# EAGLE design BJ_GIRA_Taster4.4 (EAGLE 5.04)
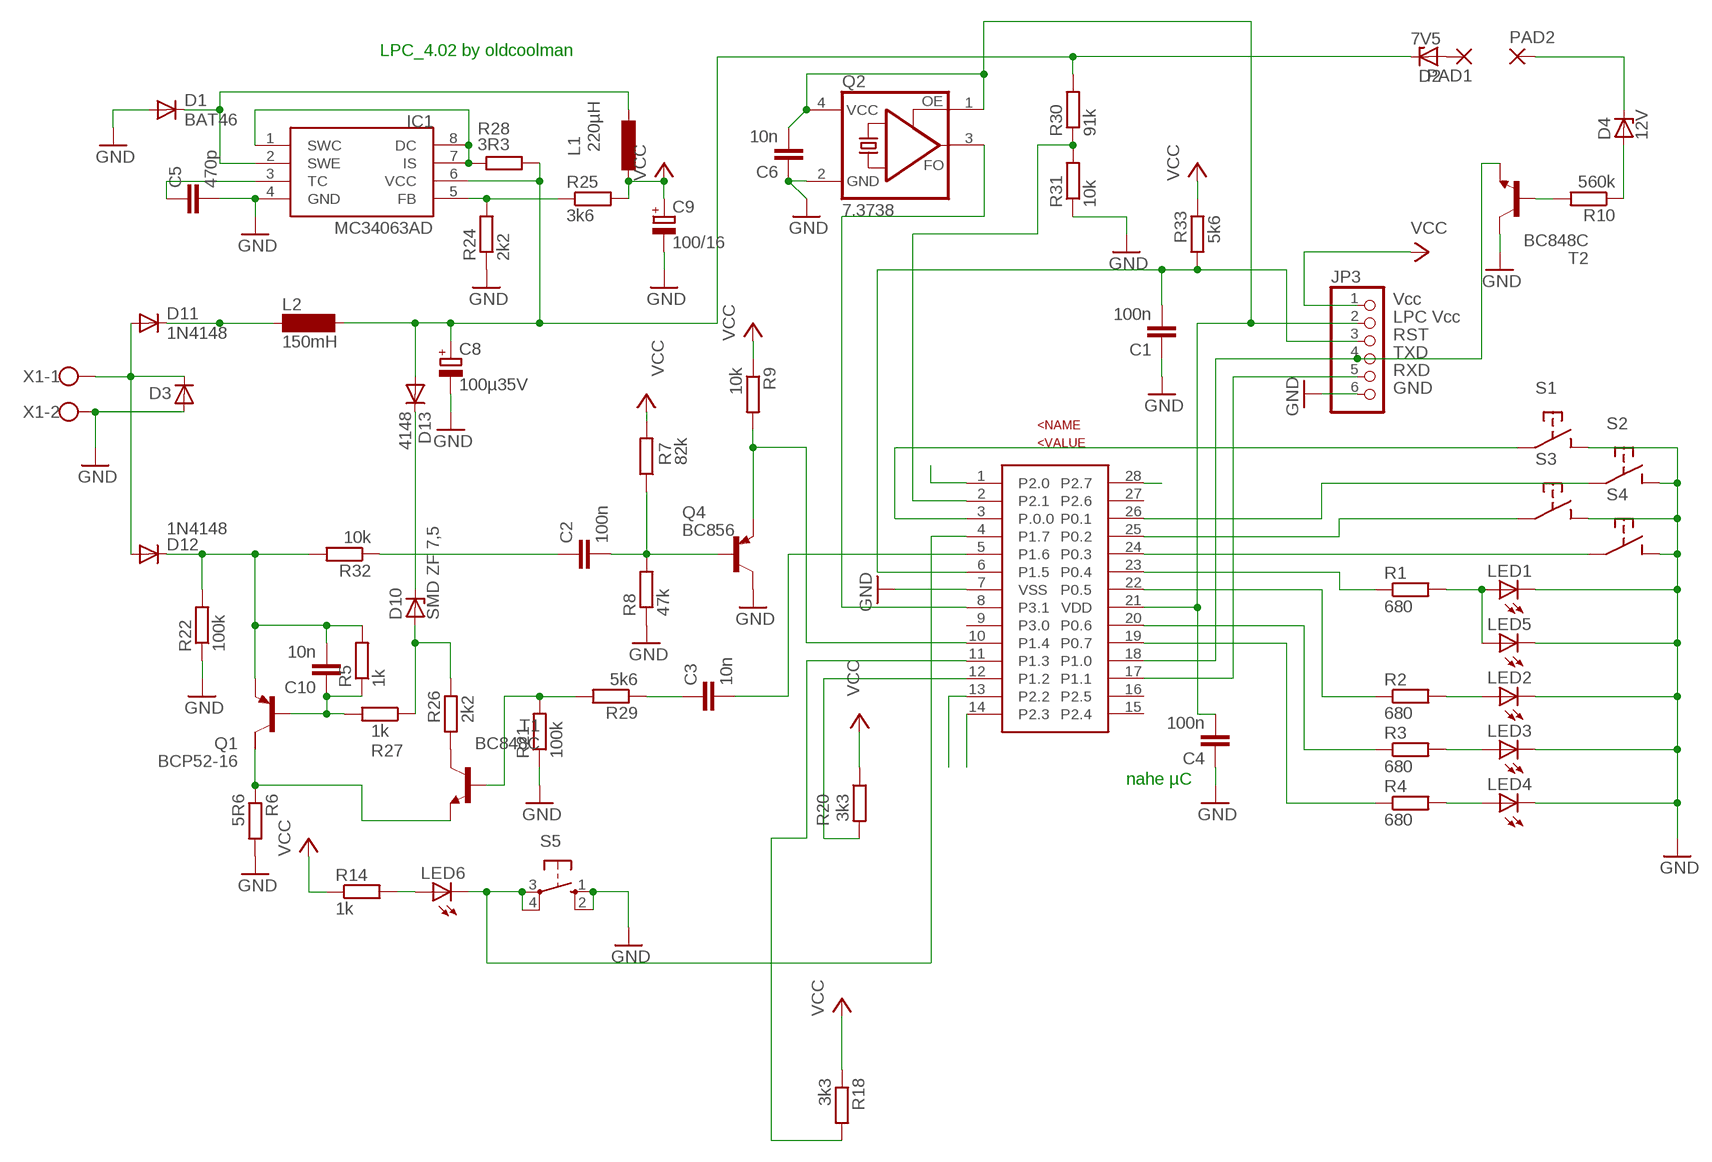
[diagram p0: schematic, sheet 1]

## Parts
C1  100n  C-EUC1206  [C1206]
C2  100n  C-EUC1206  [C1206]
C3  10n  C-EUC1206  [C1206]
C4  100n  C-EUC1206  [C1206]
C5  470p  C-EUC1206  [C1206]
C6  10n  C-EUC1206  [C1206]
C8  100µ35V  CPOL-EUE3.5-8  [E3,5-8]
C9  100/16  CPOL-EUE2.5-5  [E2,5-5]
C10  10n  C-EUC1206  [C1206]
D1  BAT46  DIODE-MINIMELF  [MINIMELF]
D2  7V5  ZPD  [MINIMELF]
D3  D-SMB  [SMB]
D4  12V  ZPD  [MINIMELF]
D10  SMD ZF 7,5  ZPD  [MINIMELF]
D11  1N4148  DIODE-MINIMELF  [MINIMELF]
D12  1N4148  DIODE-MINIMELF  [MINIMELF]
D13  4148  DIODE-MINIMELF  [MINIMELF]
IC1  MC34063AD  [SOIC8]
JP3  PINHD-1X6  [1X06]
L1  220µH  L-EU2200-11.43  [2200-11.43]
L2  150mH  BS11  [BS11]
LED1  LED3MM  [LED3MM]
LED2  LED3MM  [LED3MM]
LED3  LED3MM  [LED3MM]
LED4  LED3MM  [LED3MM]
LED5  LED3MM  [LED3MM]
LED6  LED3MM  [LED3MM]
PAD1  SMD2  [SMD1,27-2,54]
PAD2  SMD2  [SMD1,27-2,54]
Q1  BCP52-16  FZT753SMD  [SOT223]
Q2  7.3738  ASFL1  [ASF]
Q4  BC856  BC856ALT1SMD  [SOT23-BEC]
R1  680  R-EU_R1206  [R1206]
R2  680  R-EU_R1206  [R1206]
R3  680  R-EU_R1206  [R1206]
R4  680  R-EU_R1206  [R1206]
R5  1k  R-EU_R1206  [R1206]
R6  5R6  R-EU_R1206  [R1206]
R7  82k  R-EU_R1206  [R1206]
R8  47k  R-EU_M1206  [M1206]
R9  10k  R-EU_R1206  [R1206]
R10  560k  R-EU_R1206  [R1206]
R14  1k  R-EU_R1206  [R1206]
R18  3k3  R-EU_R1206  [R1206]
R20  3k3  R-EU_M1206  [M1206]
R21  100k  R-EU_R1206  [R1206]
R22  100k  R-EU_M1206  [M1206]
R24  2k2  R-EU_R1206  [R1206]
R25  3k6  R-EU_M1206  [M1206]
R26  2k2  R-EU_M1206  [M1206]
R27  1k  R-EU_R1206  [R1206]
R28  3R3  R-EU_M1206  [M1206]
R29  5k6  R-EU_R1206  [R1206]
R30  91k  R-EU_R1206  [R1206]
R31  10k  R-EU_R1206  [R1206]
R32  10k  R-EU_R1206  [R1206]
R33  5k6  R-EU_M1206  [M1206]
S1  33053305A  [3305A]
S2  33053305A  [3305A]
S3  33053305A  [3305A]
S4  33053305A  [3305A]
S5  10-XX  [B3F-10XX]
T1  BC848C  BC848  [SOT23]
T2  BC848C  BC848  [SOT23]
U$1  LPC936TSSOP28  [TSSOP28]
X1  W237-02P  [W237-132]

## Nets
DRAIN: R26.1 T1.3(C)
EIB+: D3.1(C) D11.A D12.A X1.1
EIB_AC: C10.2 D12.C Q1.3(E) R5.2 R22.2 R32.2
EIB_DC: C8.+ D2.C D13.A IC1.6(VCC) L2.2 R28.2 R30.2
EIBIN: Q4.E R9.2 U$1.10(P1.4)
GND: C1.1 C4.1 C5.2 C6.1 C8.- C9.- D1.A D3.2(A) IC1.4(GND) JP3.6 LED1.K(C) LED2.K(C) LED3.K(C) LED4.K(C) LED5.K(C) Q2.2(GND) Q4.C R6.2 R8.1 R21.1 R22.1 R24.1 R31.1 S1.P$2 S2.P$2 S3.P$2 S4.P$2 S5.1(S) S5.2(S1) T2.3(C) U$1.7(VSS) X1.2
INT0: R18.2 U$1.11(P1.3)
N$1: C10.1 Q1.1(B) R5.1 R27.2
N$2: C3.1 R29.1
N$3: D2.A PAD1.1(P)
N$4: LED2.A R2.2
N$5: LED3.A R3.2
N$6: LED4.A R4.2
N$7: R10.2 T2.1(B)
N$8: LED1.A LED5.A R1.2
N$9: LED6.A R14.2
N$10: D4.A R10.1
N$11: D4.C PAD2.1(P)
N$50: IC1.5(FB) R24.2 R25.1
N$51: D1.C IC1.2(SWE) L1.2
N$52: C5.1 IC1.3(TC)
N$53: D11.C L2.1
N$58: D10.C D13.C
N$59: Q2.3(FO) U$1.8(P3.1)
N$63: IC1.1(SWC) IC1.7(IS) IC1.8(DC) R28.1
N$75: R30.1 R31.2 U$1.2(P2.1)
N$77: C2.1 R32.1
P0.0: S1.P$1 U$1.3(P.0.0)
P0.1: S2.P$1 U$1.26(P0.1)
P0.2: S3.P$1 U$1.25(P0.2)
P0.3: S4.P$1 U$1.24(P0.3)
P0.4: R1.1 U$1.23(P0.4)
P0.6: R3.1 U$1.20(P0.6)
P0_5: R2.1 U$1.22(P0.5)
P0_7: R4.1 U$1.19(P0.7)
P2_0: U$1.1(P2.0)
P2_2: U$1.13(P2.2)
P2_3: U$1.14(P2.3)
P2_7: U$1.28(P2.7)
PROG: LED6.K(C) S5.3(P) S5.4(P1) U$1.4(P1.7)
PWM: R20.2 U$1.12(P1.2)
RECIEVE_B: C2.2 Q4.B R7.1 R8.2
RST: C1.2 JP3.3 R33.1 U$1.6(P1.5)
RXD: JP3.5 U$1.17(P1.1)
SEND_B: R21.2 R29.2 T1.1(B)
SEND_E: Q1.2(C) R6.1 T1.2(E)
SEND_REF: D10.A R26.2 R27.1
T1: C3.2 U$1.5(P1.6)
TXD: JP3.4 T2.2(E) U$1.18(P1.0)
VCC: C9.+ JP3.1 L1.1 R7.2 R9.1 R14.1 R18.1 R20.1 R25.2 R33.2
VCC_LPC: C4.2 C6.2 JP3.2 Q2.1(OE) Q2.4(VCC) U$1.21(VDD)
Unconnected: Q1.4(C/) U$1.9(P3.0) U$1.15(P2.4) U$1.16(P2.5) U$1.27(P2.6)

## Notes on the sheet
- LPC_4.02 by oldcoolman
- Vcc
- LPC Vcc
- RST
- TXD
- RXD
- GND
- nahe µC

## Library data of the parts
C1-C6 C10 = rcl:C-EU: CAPACITOR, European symbol
C8 C9 = rcl:CPOL-EU: POLARIZED CAPACITOR, European symbol
D1 D11-D13 = diode:DIODE-: DIODE
D2 D4 D10 = diode:ZPD: Z DIODE 500 mW
D3 = semicon-smd-ipc:D-: DIODE unfilled
IC1 = mc34063:MC34063
JP3 = pinhead:PINHD-1X6: PIN HEADER
L1 = rcl:L-EU: INDUCTOR, European symbol
L2 = inductor-neosid:BS: INDUCTOR nominal inductance, magnetically screened
LED1-LED6 = led:LED: LED OSRAM: - CHIPLED LG R971, LG N971, LY N971, LG Q971, LY Q971, LO R971, LY R971 LH N974, LH R974 LS Q976, LO Q976, LY Q976 LO Q996 - Hyper CHIPLED LW Q18S LB Q993, LB Q99A, LB R99A - SideLED LS A670, LO A670, LY A670, LG A670, LP A670 LB A673, LV A673, LT A673, LW A673 LH A674 LY A675 LS A676, LA A676, LO A676, LY A676, LW A676 LS A679, LY A679, LG A679 - Hyper Micro SIDELED® LS Y876, LA Y876, LO Y876, LY Y876 LT Y87S - SmartLED LW L88C, LW L88S LB L89C, LB L89S, LG L890 LS L89K, LO L89K, LY L89K LS L896, LA L896, LO L896, LY L896 - TOPLED LS T670, LO T670, LY T670, LG T670, LP T670 LSG T670, LSP T670, LSY T670, LOP T670, LYG T670 LG T671, LOG T671, LSG T671 LB T673, LV T673, LT T673, LW T673 LH T674 LS T676, LA T676, LO T676, LY T676, LB T676, LH T676, LSB T676, LW T676 LB T67C, LV T67C, LT T67C, LS T67K, LO T67K, LY T67K, LW E67C LS E67B, LA E67B, LO E67B, LY E67B, LB E67C, LV E67C, LT E67C LW T67C LS T679, LY T679, LG T679 LS T770, LO T770, LY T770, LG T770, LP T770 LB T773, LV T773, LT T773, LW T773 LH T774 LS E675, LA E675, LY E675, LS T675 LS T776, LA T776, LO T776, LY T776, LB T776 LHGB T686 LT T68C, LB T68C - Hyper Mini TOPLED® LB M676 - Mini TOPLED Santana® LG M470 LS M47K, LO M47K, LY M47K Source: http://www.osram.convergy.de - LUMILED® LXK2-PW12-R00, LXK2-PW12-S00, LXK2-PW14-U00, LXK2-PW14-V00 LXK2-PM12-R00, LXK2-PM12-S00, LXK2-PM14-U00 LXK2-PE12-Q00, LXK2-PE12-R00, LXK2-PE12-S00, LXK2-PE14-T00, LXK2-PE14-U00 LXK2-PB12-K00, LXK2-PB12-L00, LXK2-PB12-M00, LXK2-PB14-N00, LXK2-PB14-P00, LXK2-PB14-Q00 LXK2-PR12-L00, LXK2-PR12-M00, LXK2-PR14-Q00, LXK2-PR14-R00 LXK2-PD12-Q00, LXK2-PD12-R00, LXK2-PD12-S00 LXK2-PH12-R00, LXK2-PH12-S00 LXK2-PL12-P00, LXK2-PL12-Q00, LXK2-PL12-R00 Source: www.luxeon.com
PAD1 PAD2 = wirepad:SMD2: SMD PAD
Q1 = transistor-pnp:FZT753SMD: PNP Transistor
Q2 = crystal:ASF*: CRYSTAL CLOCK OSCILLATORS 5.0 Vdc or 3.3 Vdc - LOW PROFILE ULTRA MINIATURE CERAMIC SURFACE MOUNT Source: http://www.abracon.com/Oscillators/asf1-L-L1.pdf
Q4 = transistor-pnp:BC856*: PNP Transistror
R1-R10 R14 R18 R20-R22 R24-R33 = rcl:R-EU_: RESISTOR, European symbol
S1-S4 = kubi:3305: Taster 3305
S5 = switch-omron:10-XX: OMRON SWITCH
T1 T2 = transistor:BC848: NPN TRANSISTOR
U$1 = freebuslpc:LPC936: C51 Based Microcontroller LPC936 ADC and 16kbyte Flash
X1 = con-wago-508:W237-02P: WAGO SREW CLAMP

## Board
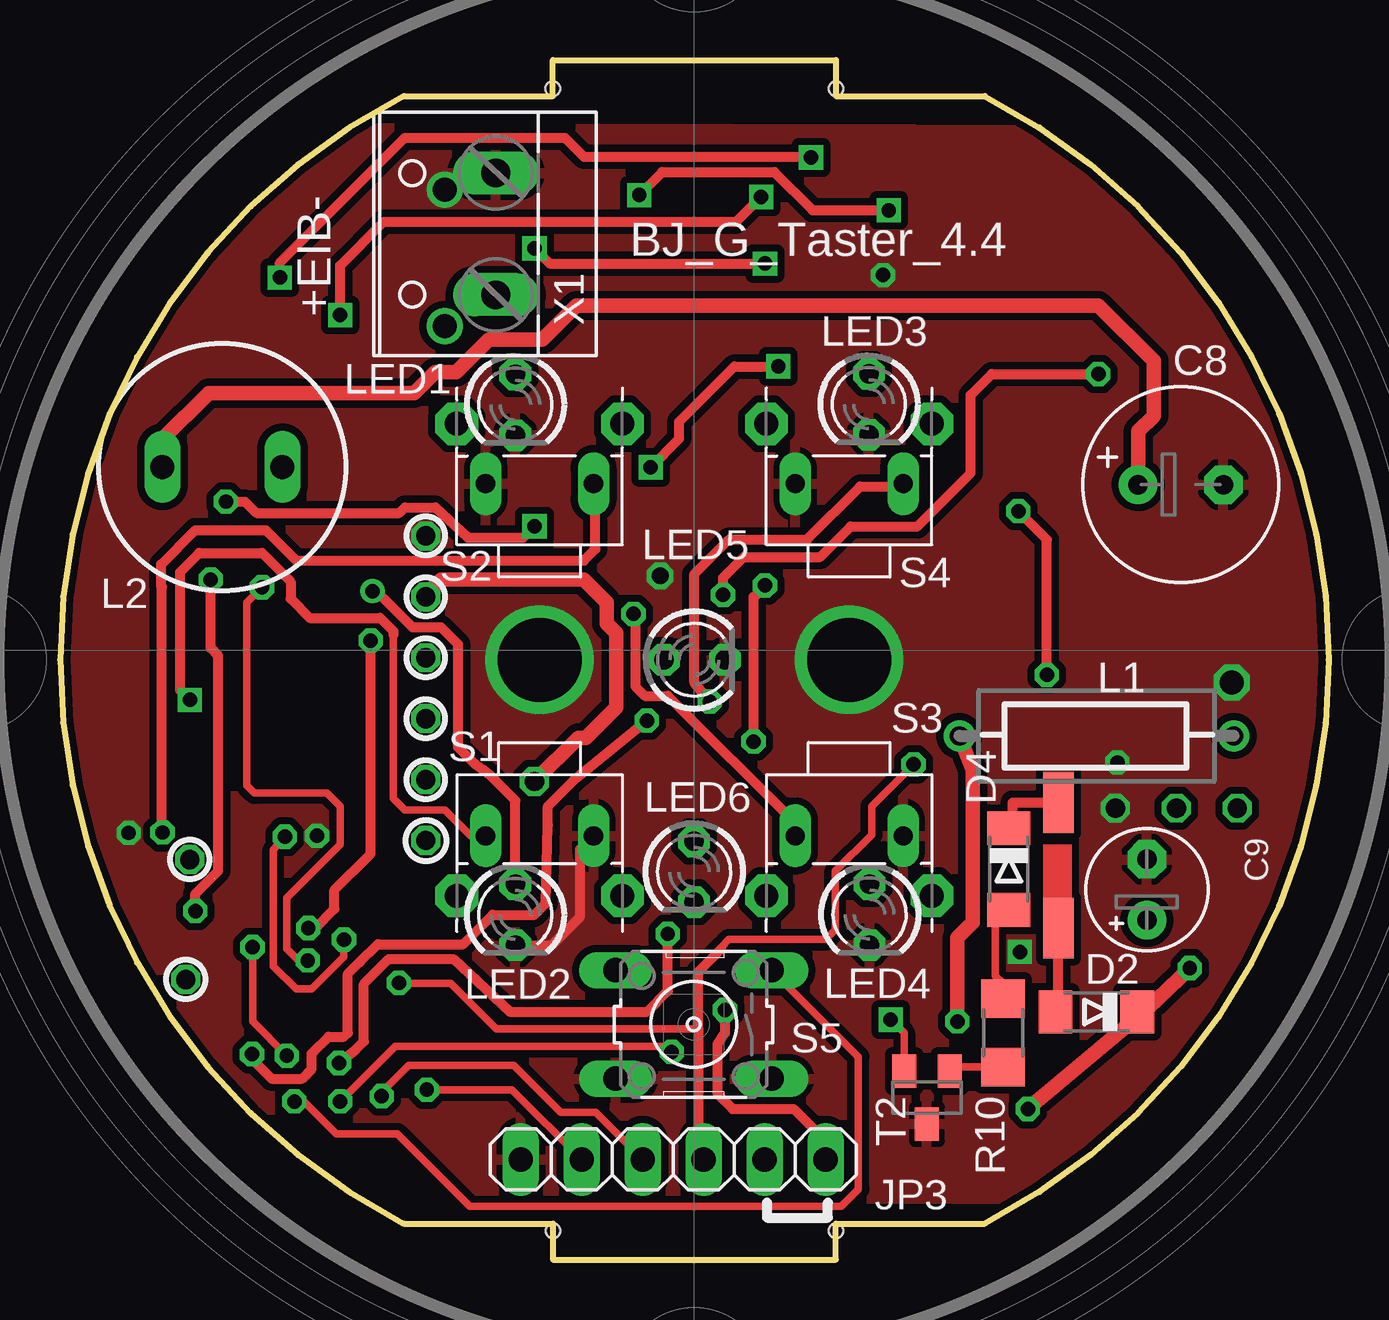
[diagram p1: board, top side]
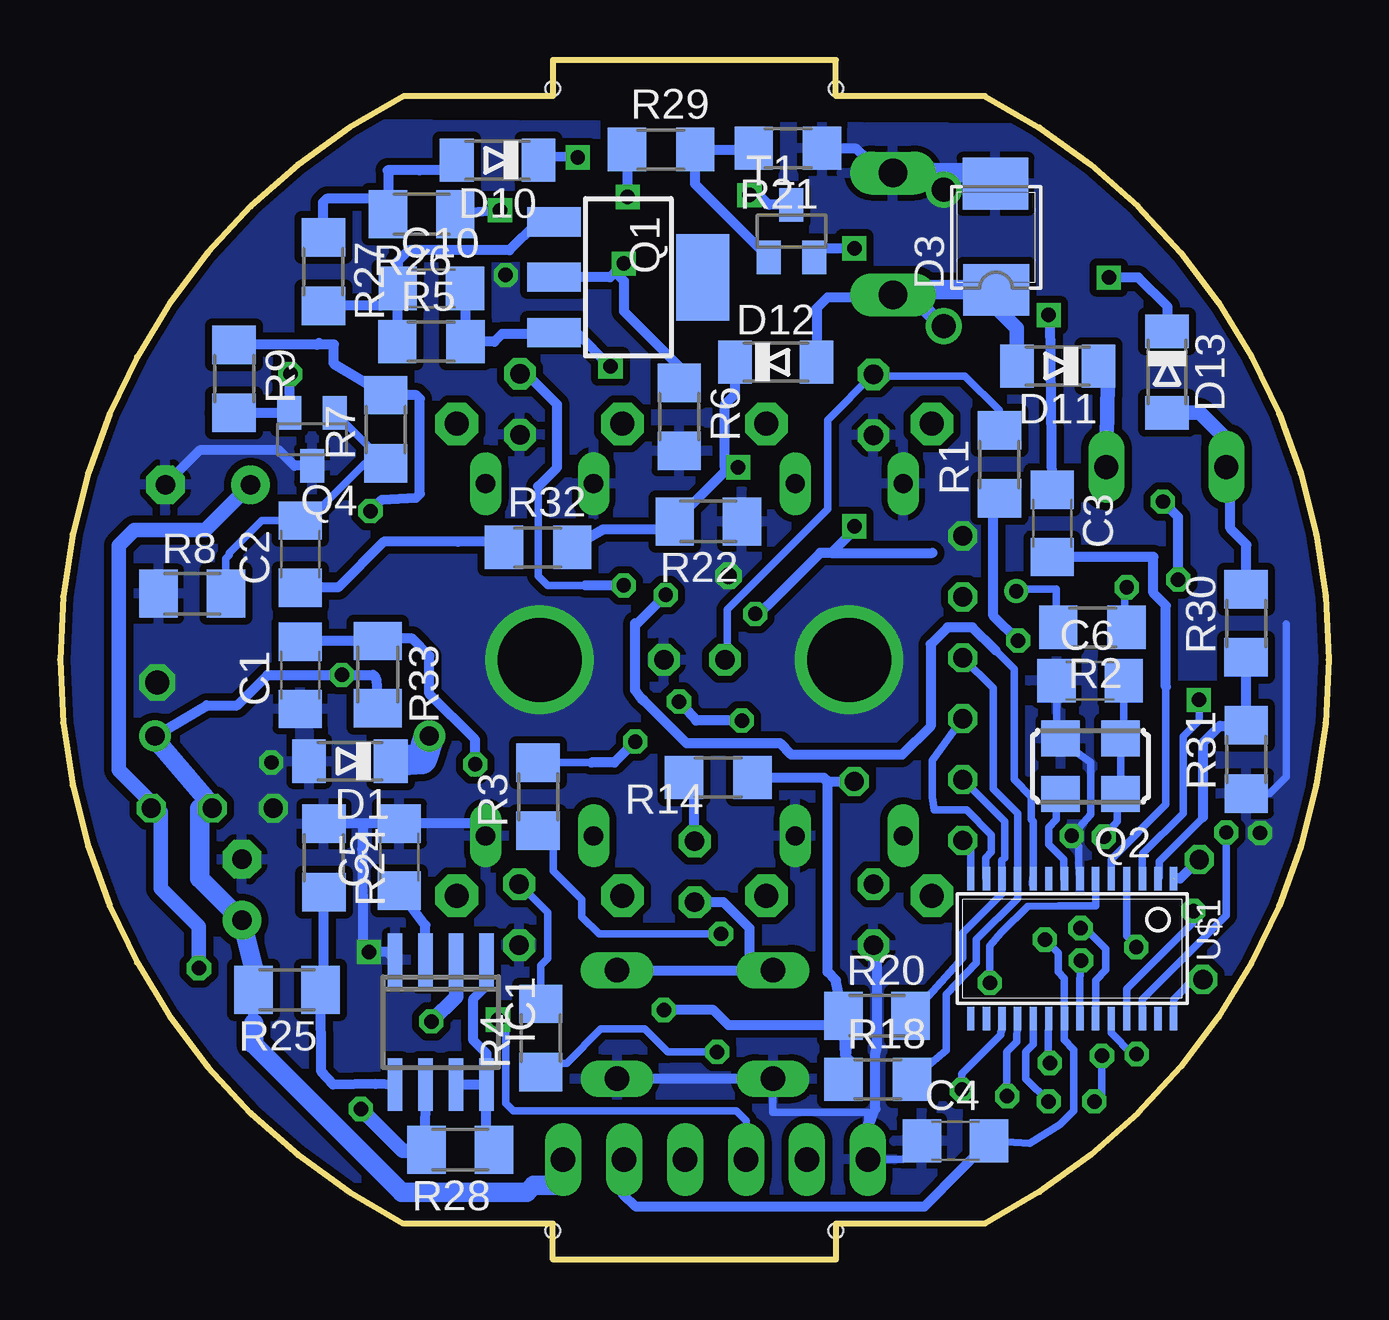
[diagram p2: board, bottom side, seen from below]

Size 52.86 x 50 mm. Coordinates in mm from the lower left corner, seen from the top.
Outline: 20.53,48.5 20.53,50 32.33,50 32.33,48.5 38.53,48.5 arc-126 38.53,1.5 32.33,1.5 32.33,0 20.53,0 20.53,1.5 14.33,1.5 arc-126 14.33,48.5 20.53,48.5
Copper layers (1*16): Top 0.035mm / dielectric 1.5mm / Bottom 0.035mm
Design rules "default *": minimum track width 10mil, minimum drill 0.5mm, track to track 8mil, track to pad 8mil, pad to pad 8mil, via to via 8mil, smd to smd 8mil, copper to edge 10mil, drill to drill 8mil, minimum pad ring 10mil, minimum via ring 8mil, stop-mask expansion 4mil, vias tented up to drill 0.7mm, thermal gap 10mil
Holes 0.6 mm at 20.53,48.8 32.33,48.8 20.54,1.2 32.33,1.2
tKeepout: area 3.2,37.4 to 11.1,41.4; area 41.9,37.4 to 49.5,41.4; area 4.1,9.5 to 11.6,13.4; area 41.9,8.6 to 49.5,12.6; area 17.2,22.2 to 22.8,27.8
bRestrict: area 9.5,25.7 to 10.2,27.4

### Footprints (pad centres in the part's own frame; a part is rotated, then mirrored left to right if it is on the bottom)
C1206 = smd 1.6 x 1.8: 1 -1.4,0; 2 1.4,0
E3,5-8 = drill 0.813 pad 1.6 round: + -1.778,0 | drill 0.813 pad 1.6 octagon: - 1.778,0
E2,5-5 = drill 0.813 pad 1.6 round: + -1.27,0 | drill 0.813 pad 1.6 octagon: - 1.27,0
MINIMELF = smd 1.4 x 1.8: A 1.7,0; C -1.7,0
SMB = smd 2.159 x 2.743: 1 -2.311,-0.127; 2 2.108,-0.102
SOIC8 = smd 0.6 x 2.2: 1 -1.905,-2.6; 2 -0.635,-2.6; 3 0.635,-2.6; 4 1.905,-2.6; 5 1.905,2.6; 6 0.635,2.6; 7 -0.635,2.6; 8 -1.905,2.6
1X06 = drill 1.016 long: 1 -6.35,0; 2 -3.81,0; 3 -1.27,0; 4 1.27,0; 5 3.81,0; 6 6.35,0
2200-11.43 = drill 0.8 pad 1.27 round: 1 -5.715,0; 2 5.715,0
BS11 = drill 1 long: 1 -2.5,0; 2 2.5,0
LED3MM = drill 0.813 octagon: A -1.27,0; K 1.27,0
SMD1,27-2,54 = smd 1.27 x 2.54: 1 0,0
SOT223 = smd 1.219 x 2.235: 1 -2.311,-3.099; 2 0,-3.099; 3 2.311,-3.099 | smd 3.6 x 2.2: 4 0,3.099
ASF = smd 1.6 x 1.5: 1 -1.25,-1.15; 2 1.25,-1.15; 3 1.25,1.15; 4 -1.25,1.15
SOT23-BEC = smd 1 x 1.4: B -0.95,-1.1; C 0,1.1; E 0.95,-1.1
R1206 = smd 1.6 x 1.803: 1 -1.422,0; 2 1.422,0
M1206 = smd 1.6 x 2: 1 -1.4,0; 2 1.4,0
3305A = drill 0.8 long: P$1 -2.25,0; P$2 2.25,0 | drill 1 pad 1.778 octagon: P$3 -3.45,-2.5; P$4 3.45,-2.5
B3F-10XX = drill 1.016 long: 1 -3.251,2.261; 2 3.251,2.261; 3 -3.251,-2.261; 4 3.251,-2.261
SOT23 = smd 1 x 1.4: 1 -0.95,-1.1; 2 0.95,-1.1; 3 0,1.1
TSSOP28 = smd 0.305 x 0.991: 1 -4.225,-2.918; 2 -3.575,-2.918; 3 -2.925,-2.918; 4 -2.275,-2.918; 5 -1.625,-2.918; 6 -0.975,-2.918; 7 -0.325,-2.918; 8 0.325,-2.918; 9 0.975,-2.918; 10 1.625,-2.918; 11 2.275,-2.918; 12 2.925,-2.918; 13 3.575,-2.918; 14 4.225,-2.918; 15 4.225,2.918; 16 3.575,2.918; 17 2.925,2.918; 18 2.275,2.918; 19 1.625,2.918; 20 0.975,2.918; 21 0.325,2.918; 22 -0.325,2.918; 23 -0.975,2.918; 24 -1.625,2.918; 25 -2.275,2.918; 26 -2.925,2.918; 27 -3.575,2.918; 28 -4.225,2.918
W237-132 = drill 1.194 long: 1 -2.54,-0.635; 2 2.54,-0.635

### Placement (x,y rotation side)
C1  42.86,24.35 90 bottom
C2  42.86,29.4 90 bottom
C3  11.52,30.68 270 bottom
C4  15.55,4.95 0 bottom
C5  38.72,16.77 90 bottom
C6  9.94,24.13 0 bottom
C8  46.7,32.3 0 top
C9  45.29,15.41 90 top
C10  37.39,40.48 0 bottom
D1  40.78,20.77 180 bottom
D2  43.18,10.32 180 top
D3  13.99,42.73 90 bottom
D4  39.53,16.27 270 top
D10  34.63,45.82 180 bottom
D11  11.29,37.24 180 bottom
D12  23.04,37.4 0 bottom
D13  6.74,36.99 270 bottom
IC1  37,9.89 180 bottom
JP3  25.55,4.17 180 top
L1  43.19,21.82 180 top
L2  6.76,33.04 180 top
LED1  18.97,35.63 270 top
LED2  18.97,14.37 270 top
LED3  33.7,35.65 270 top
LED4  33.73,14.38 270 top
LED5  26.43,25 0 top
LED6  26.42,16.16 270 top
PAD1  41.6,13.81 0 top
PAD2  41.6,19.05 0 top
Q1  29.18,40.94 270 bottom
Q2  9.93,20.56 180 bottom
Q4  42.36,34.19 180 bottom
R1  13.72,33.14 90 bottom
R2  9.85,26.35 180 bottom
R3  32.94,19.29 90 bottom
R4  32.84,9.24 90 bottom
R5  37.39,38.26 0 bottom
R6  27.07,35.13 270 bottom
R7  39.29,34.61 90 bottom
R8  47.35,27.75 0 bottom
R9  45.61,36.71 270 bottom
R10  39.29,9.45 270 top
R14  25.44,20.09 180 bottom
R18  18.79,7.51 0 bottom
R20  18.82,10.17 0 bottom
R21  22.53,46.33 180 bottom
R22  25.85,30.77 180 bottom
R24  41.87,16.74 270 bottom
R25  43.4,11.24 180 bottom
R26  37.8,43.57 180 bottom
R27  41.89,41.18 270 bottom
R28  36.19,4.58 180 bottom
R29  27.82,46.27 0 bottom
R30  3.44,26.52 90 bottom
R31  3.43,20.84 90 bottom
R32  32.94,29.69 0 bottom
R33  39.62,24.38 270 bottom
S1  19.98,17.66 0 top
S2  19.98,32.34 180 top
S3  32.88,17.66 0 top
S4  32.88,32.34 180 top
S5  26.4,9.8 180 top
T1  22.39,42.86 0 bottom
T2  36.12,6.75 180 top
U$1  10.69,12.96 180 bottom
X1  17.52,42.75 90 top

### Tracks (layer width: path | path; a pad name or v marks a point on that pad's centre or on a via)
DRAIN  (via drill 0.6)
  Top 0.406: v24.13,44.37 25.09,45.32 29.77,45.32 31.36,43.74 v34.53,43.74
  Bottom 0.406: 36.32,43.66 R26.1 v34.54,43.73 v34.53,43.74 | T1.3 23.33,43.96 23.74,44.37 v24.13,44.37
EIB+  (via drill 1)
  Bottom 0.406: 14.26,40.1 D3.1 | D12.A 21.34,39.65 20.89,40.1 18.59,40.1 X1.1 17.95,40.42
  Bottom 0.61: 14.26,40.1 12.99,38.83 D11.A | v16.03,38.9 16.11,38.9 17.63,40.42
  Bottom 0.813: D3.1 17.63,40.42 17.95,40.42
EIB_AC  (via drill 0.6)
  Top 0.406: v29.93,37.23 28.1,37.23 25.8,34.93 25.8,34.21 v24.61,33.02
  Bottom 0.406: C10.2 35.97,40.46 R5.2 34.77,38.26 34.53,38.5 34.45,38.58 32.33,38.58 Q1.3 | Q1.3 32.28,38.65 | R32.2 30.22,30.43 27.59,30.43 R22.2 25.17,32.85 25.17,33.02 | D12.C 24.74,36.07 25.17,35.64 25.17,33.02 | Q1.3 31.33,38.63 v29.93,37.23 | v24.61,33.02 25.17,33.02
EIB_DC  (via drill 0.6, 0.8)
  Top 0.305: D2.C 45.04,10.76 45.33,10.48
  Top 0.61: v47.07,12.14 45.33,10.48 v40.33,6.27 | L2.2 4.25,33.05 4.25,34.17 6.19,36.12 14.77,36.12 15.64,36.99 16.51,36.99 17.86,38.34 20.09,38.34 21.51,39.77 43.26,39.77 45.57,37.47 45.57,35.16 44.93,34.53 C8.+
  Bottom 0.406: 4.12,32.98 L2.2 4.1,32.98 4.1,30.47 3.43,29.8 3.43,27.95 R30.2 | IC1.6 37.64,4.7 R28.2 37.64,4.53
  Bottom 0.61: D13.A 5.37,35.29 4.1,34.03 4.1,33 L2.2 | 48.94,18.93 50.41,20.4 50.41,29.77 49.77,30.4 46.82,30.4 C8.+ | 48.94,18.93 48.66,18.65 48.66,15.48 47.07,13.89 v47.07,12.14 | v40.33,6.27 38.58,4.53 37.64,4.53 | v49.06,18.81 | 48.94,18.93 v49.06,18.81
EIBIN  (via drill 0.6)
  Top 0.406: v43.26,36.91 38.82,36.91 37.95,36.04 37.95,32.78 35.72,30.56 32.95,30.56 31.67,29.29 28.5,29.29 27.63,28.42 v27.63,27.7
  Bottom 0.305: 12.33,15.9 12.35,15.64 U$1.10 12.32,18.27 12.39,18.34 12.39,19.29 13.1,20 13.1,24.61 13.89,25.4
  Bottom 0.406: 46.33,35.29 R9.2 Q4.E 43.31,36.86 v43.26,36.91 | 28.02,22.78 28.5,23.26 28.66,23.42 28.9,23.73 28.9,26.51 28.82,26.51 v27.63,27.7 | 28.02,22.78 | 28.02,22.78 26.75,21.51 22.86,21.51 22.39,21.04 17.78,21.04 16.59,22.23 16.59,25.64 15.88,26.35 14.85,26.35 13.89,25.4
GND  (via drill 0.6, 0.7, 0.8, 1, 3.5)
  Top 0.305: v10.71,17.66 10.56,17.67
  Top 0.406: v39.99,12.82 40.24,12.81 | LED2.K 20.49,13.1 21.67,14.29 21.67,17.1 S1.P$2
  Bottom 0.305: U$1.7 10.38,15.89 10.41,16.43 10.41,17.22 v10.71,17.66 | R31.1 2.46,19.42 1.77,20.11 1.77,26.5 | C4.1 17.73,4.17 JP3.6 19.2,5.64 19.2,6.13 19.21,6.14 23.16,6.14 S5.2 | v10.71,17.66 10.71,17.69 | C6.1 11.34,21.88 Q2.2 11.31,21.71 9.93,20.72 9.93,18.54 v10.71,17.66
  Bottom 0.406: 40.24,18.17 C5.2 35.65,18.17 S3.P$2 | 40.24,18.17 41.71,18.17 R24.1 | 40.24,18.17 40.27,17.09 40.24,13.39 | 29.67,7.53 S5.1 S5.2 | 17.93,45.12 X1.2 19.42,46.04 19.68,46.3 21.08,46.3 | 21.08,46.3 R21.1 | 38.96,12.74 IC1.4 39.23,12.82 v39.99,12.82 | Q4.C 43.1,33.09 43.74,33.73 47.04,33.73 C8.- | LED2.K 18.82,12.94 18.82,8.89 18.9,8.57 18.9,6.27 19.13,5.64 19.2,5.64 | 21.08,46.3 21.29,46.3
  Bottom 0.813: D3.2 14.52,44.95 14.88,45.31 18.14,45.31 X1.2
  other vias: 25.01,28.5 2.86,17.78 34.29,41.04 43.98,18.81 44.06,20.72 48.82,24.05 19.98,25 32.88,25 15.24,30.16 16.04,44.6
  pour Bottom (isolate 0.305): -2.4,44.85 -2.09,47.08 51.66,47.38 53.41,46.59 54.05,8.65 48.33,2.46 -1.92,2.46
  pour Top (isolate 0.305): -3.06,44.84 -2.59,47.23 51,47.08 53.06,42.63 53.68,12.46 53.05,2.46 -2.58,2.61
INT0  (via drill 0.8)
  Bottom 0.305: 16.78,7.7 R18.2 15.93,8.72 15.93,11.05 14.69,12.37 14.69,13.34 12.97,15.06 U$1.11 12.97,18.6 13.97,19.61 13.97,23.81 v15.24,25.08
N$1
  Bottom 0.406: Q1.1 32.28,43.12 32.34,43.18 33.02,43.18 34.14,42.07 38.34,42.07 38.79,41.62 C10.1 | C10.1 38.81,40.46 R5.1 | C10.1 39.52,39.76 R27.2
N$2  (via drill 0.6)
  Top 0.406: v29.21,44.29 28.18,43.26 13.5,43.26 11.67,41.43 v11.67,39.37
  Bottom 0.406: R29.1 29.21,46.24 v29.21,44.29 | v11.67,39.37 11.6,39.3 C3.1
N$3
  Top 0.406: D2.A 41.6,10.32 PAD1.1
N$4  (via drill 0.6)
  Top 0.406: LED2.A 18.97,19.13 17.94,20.16 17.63,20.4 17.31,20.64 16.59,21.35 16.59,25.64 15.88,26.35 15.01,26.35 14.69,26.35 13.34,27.7 13.18,27.86 v13.02,27.86
  Bottom 0.305: v13.02,27.86 12.86,27.94 11.35,27.94 11.36,27.7 11.36,26.99
  Bottom 0.406: 11.36,26.99 R2.2
N$5  (via drill 0.6)
  Top 0.406: v28.9,21.59 28.9,27.62 v29.37,28.1
  Bottom 0.305: 32.95,32.23 32.95,28.5 32.55,28.1 30.96,28.1 | 30.72,20.72 R3.2
  Bottom 0.406: LED3.A 33.43,36.92 32.15,35.64 32.15,33.02 32.95,32.23 | 30.72,20.72 29.77,20.72 v28.9,21.59 | v29.37,28.1 30.96,28.1
N$6
  Bottom 0.305: R4.2 32.84,12.25 32.55,12.54 32.55,14.47 LED4.A
N$7
  Top 0.305: R10.2 37.25,8.02 T2.1
N$8
  Bottom 0.254: LED1.A 18.97,36.87
  Bottom 0.305: 25.05,24.89 25.05,27.1 20.88,31.27 20.88,34.99 LED1.A 18.9,36.83 15.17,36.83 13.74,35.4 13.74,34.98 R1.2
  Bottom 0.406: 25.05,24.89 LED5.A
N$9
  Bottom 0.406: LED6.A 26.44,17.45 26.44,20.08 R14.2
N$10
  Top 0.305: R10.1 39.29,11.51 38.98,11.83 38.98,14.02 D4.A
N$11
  Top 0.406: D4.C 39.69,17.97 39.69,19.05 PAD2.1
N$50
  Bottom 0.406: R24.2 41.87,11.38 R25.1 | R25.1 41.82,11.24 | IC1.5 39.72,7.32 41.48,7.29 41.98,7.83 R25.1
N$51  (via drill 0.6)
  Top 0.61: v37.39,9.92 37.39,13.41 38.03,14.05 38.03,20.4 L1.2
  Bottom 0.61: IC1.2 36.36,10.95 v37.39,9.92
  Bottom 1.27: L1.2 37.79,20.87 D1.C
N$52
  Bottom 0.406: IC1.3 37.64,13.93 C5.1
N$53
  Bottom 0.61: L2.1 9.21,36.56 D11.C
N$58  (via drill 0.6)
  Top 0.406: v9.16,40.93 9.16,41.54 14.37,46.75 21.04,46.75 21.83,45.96 30.95,45.96 v31.29,45.94
  Bottom 0.406: 33.01,45.42 D10.C 33.43,45.42 33.43,45.95 31.27,45.97 v31.29,45.94 | v9.16,40.93 7.93,40.93 6.71,39.71 6.71,38.72 D13.C
N$59
  Bottom 0.305: U$1.8 11.04,15.87 11.04,16.67 11.67,17.3 11.67,18.02 11.35,18.34 11.35,19.39 Q2.3 11.04,19.11
N$63
  Bottom 0.406: IC1.8 IC1.7 | R28.1 34.5,5.22 35.11,5 35.11,7.04 IC1.8 | IC1.1 35.17,12.42 35.17,11.35 35.64,10.88 35.64,9.13 35.09,8.58 IC1.8
N$75
  Bottom 0.305: U$1.2 7.07,15.93 7.07,16.59 5.23,18.43
  Bottom 0.406: R30.1 R31.2 3.45,22.25 4.53,22.25 5.23,21.55 5.23,18.43
N$77
  Bottom 0.406: R32.1 34.93,29.92 36.28,29.92 39.37,29.92 41.28,28.02 42.84,28.02 C2.1
P0.0  (via drill 0.6)
  Top 0.305: S1.P$1 17.11,17.66 16.04,18.73 14.37,18.73 13.89,19.21 13.89,26.04
  Top 0.406: v5.41,23.33 5,23.74 5,28.66 5.8,29.45 8.42,29.45 9.61,28.26 9.61,27.54 10.4,26.75 13.34,26.75 13.89,26.19 13.89,26.04
  Bottom 0.305: U$1.3 7.77,16.76 7.74,16.92 6.07,18.59 6.07,21.8 5.4,22.47 v5.4,23.32 v5.41,23.33
P0.1  (via drill 0.6)
  Top 0.406: v4.27,17.8 4.24,17.83 4.24,28.05 4.21,28.08 4.21,28.97 5.64,30.4 8.58,30.4 9.85,29.13 21.83,29.13 22.31,29.61 22.31,32.26 S2.P$1
  Bottom 0.305: v4.27,17.8 4.27,14.34 7.76,10.85 U$1.26
P0.2  (via drill 0.6)
  Top 0.406: v5.64,14.53 5.64,15.24 6.59,16.19 6.59,25.16 6.27,25.48 v6.27,28.34 | v23.9,26.91 23.98,26.83 23.98,23.89 24.37,23.5 25.32,23.5 30.63,18.19 S3.P$1 | v6.91,31.59 7.7,31.59 8.18,31.12 14.13,31.12 14.37,31.35 15.64,31.35 16.99,30.08 19.29,30.08 v19.77,30.56
  Bottom 0.305: U$1.25 8.42,11.27 5.64,14.05 v5.64,14.53
  Bottom 0.406: v23.9,26.91 23.42,27.23 21.2,29.45 20.72,29.45 | 20.72,29.45 16.51,29.45 | v6.27,28.34 6.27,30.96 v6.91,31.59 | v19.77,30.56 19.77,30.4 20.72,29.45
P0.3  (via drill 0.6)
  Top 0.406: 8,8.35 v8,8.56 8,8.35 8.82,7.54 10.09,7.54 10.48,7.94 10.48,8.57 10.56,8.65 11.2,9.29 11.83,9.29 11.99,9.45 11.99,11.91 12.49,12.4 12.5,12.4 13.24,13.14 16.8,13.14 18.02,14.37 19.77,14.37 20.24,14.84 20.32,18.1 20.32,18.89 21.51,20.08 v24.45,22.46 | S4.P$1 35.02,32.23 33.34,32.23 31.12,30 27.87,30 26.44,28.58 26.44,24.05 v27.07,23.26
  Bottom 0.305: v8,8.56 8.18,8.56 9.07,9.45 U$1.24
  Bottom 0.406: v27.07,23.26 26.36,22.46 v24.45,22.46
P0.4  (via drill 0.6)
  Top 0.406: v10.34,13.81 10.64,13.81 11.43,14.61 11.43,15.4 12.94,16.91 v12.94,25.8
  Bottom 0.305: U$1.23 9.72,11.64 9.29,12.07 9.29,12.94 10.09,13.73 10.26,13.73 v10.34,13.81
  Bottom 0.406: v12.94,25.8 13.97,26.83 13.97,31.39 R1.1
P0.6  (via drill 0.6)
  Top 0.305: v11.62,8.19 v11.63,8.2
  Top 0.406: v11.63,8.2 12.31,8.73 12.66,9.09 12.66,11.49 13.7,12.52 16.38,12.52 18.73,10.33 24.46,10.33 25.32,11.19 v25.32,13.57
  Bottom 0.305: 11.68,8.3 11.68,9.14 U$1.20 | v25.32,13.57 30.41,13.57 31.12,14.29 31.12,15 32.31,16.19 32.31,17.23 R3.1
  Bottom 0.406: v11.62,8.19 11.57,8.19 11.68,8.3
P0_5  (via drill 0.6)
  Top 0.305: v10.32,12.46 9.93,12.46 9.45,12.94 9.45,15.08 9.69,15.32 | 9.69,15.32 | 9.69,15.32 11.67,17.3 11.67,18.89 11.12,19.45 8.1,19.45 7.78,19.77 7.78,27.38 v8.42,28.02
  Bottom 0.305: U$1.22 10.37,11.55 v10.32,12.46 | v8.42,28.02 8.5,27.86 8.5,26.43 R2.1
P0_7  (via drill 0.6)
  Top 0.305: v11.67,6.59 13.97,8.89 17.47,8.89 | 17.47,8.89 17.31,8.89 | 17.47,8.89 25.33,8.89 v25.48,8.65
  Bottom 0.305: U$1.19 12.31,8.97 12.62,8.65 12.62,7.54 v11.67,6.59 | v25.48,8.65 27.55,8.65 28.5,9.61 30.33,9.61 31.75,8.18 32.8,8.18 R4.1
P2_0  (via drill 0.8)  (1 unrouted)
  Bottom 0.406: 6.43,15.88 6.2,15.88 v5.4,16.67
P2_2  (via drill 0.8)
  Bottom 0.305: v15.24,22.54 16.51,20.8 16.51,19.29 16.43,18.73 15.09,18.73 14.05,17.7 14.05,16.99 14.29,16.75 14.29,15.88 U$1.13
P2_3  (via drill 0.8)
  Bottom 0.305: 15.17,17.46 v15.24,17.46 14.93,17.15 14.93,16.03 14.92,16.02 U$1.14
P2_7  (via drill 0.8)
  Bottom 0.305: U$1.28 6.47,10.84 5.64,11.67 v5.24,11.67
PROG  (via drill 0.6)
  Top 0.305: v8.02,13.02 8.02,9.92 v9.45,8.49 | v9.77,6.59 10.16,6.59 11.04,5.72 | 11.04,5.72 | 11.04,5.72 11.51,5.24 14.05,5.24 17.07,2.22 32.55,2.22 33.26,2.94 33.26,8.45 S5.3
  Bottom 0.305: U$1.4 8.42,13.49 7.94,13.02 v8.02,13.02 | v9.45,8.49 9.45,6.91 v9.77,6.59
  Bottom 0.406: 23.98,12.06 S5.4 | S5.3 23.98,12.06 | LED6.K 25.21,14.89 24.13,13.81 24.13,12.22 23.98,12.06
PWM  (via drill 0.8)
  Bottom 0.305: R20.2 15.25,12.57 15.25,13.61 14.5,14.36 14.49,14.36 13.62,15.24 U$1.12 13.62,16.63 13.5,16.75 13.5,18.26 v15.24,20
RECIEVE_B
  Bottom 0.305: 45.99,27.72 R8.2 45.95,29.22 45.8,29.37 45.8,29.45 44.45,30.8 C2.2 42.54,30.8 40.17,33.18 R7.1 41.4,35.29 Q4.B
RST  (via drill 0.6)
  Top 0.305: v14.12,11.53 14.14,11.51 16.28,11.51 18.18,9.61 26.6,9.61 | 27.55,12.94 27.55,13.02 27.87,13.34 31.91,13.34 32.31,13.73 32.31,16.19 33.82,17.7 33.82,18.89 v35.56,20.64
  Top 0.406: 27.55,12.94 26.6,11.99 26.6,9.61 26.6,4.4 JP3.3
  Bottom 0.305: 14.15,11.51 v14.12,11.53 14.12,13.07 13.64,13.63 12.54,14.72 11.25,14.74 9.72,14.74 9.71,14.73 U$1.6
  Bottom 0.406: R33.1 39.62,25.94 | R33.1 42.59,25.78 C1.2 | v35.56,20.64 35.56,21.67 37.47,23.57 37.47,25.16 38.18,25.88 39.56,25.88 R33.1
RXD  (via drill 0.6)
  Top 0.305: v15.28,7.08 18.83,7.08 JP3.5
  Bottom 0.305: U$1.17 13.62,9.54 13.66,9.5 13.66,9.37 15.28,7.74 v15.28,7.08
SEND_B
  Bottom 0.406: R21.2 24.02,46.27 R29.2 | R29.2 26.37,46.24 | T1.1 26.4,44.82 R29.2
SEND_E  (via drill 0.6)
  Top 0.406: v29.37,41.51 20.4,41.51 v19.77,42.15
  Bottom 0.406: Q1.2 29.94,40.94 29.73,41.16 | v29.37,41.51 29.73,41.16 | v19.77,42.15 21.05,42.15 T1.2 | R6.1 27.07,37.22 29.37,39.53 29.37,40.8 29.73,41.16
SEND_REF
  Bottom 0.406: D10.A 36.89,45.4 37.88,45.4 37.89,45.4 39.22,45.4 39.2,45.38 R26.2 39.2,44.03 39.37,44.21 41.76,44.21 41.91,44.05 41.91,42.62 R27.1
T1
  Bottom 0.305: U$1.5 9.07,16.68 6.78,18.97 6.78,23.87
  Bottom 0.406: 6.78,23.87 6.78,27.26 7.31,27.78 7.31,29.29 C3.2 11.65,29.4
TXD  (via drill 0.6)
  Top 0.305: v13.4,6.81 13.4,6.97 14.52,8.09 18.9,8.09 20.86,6.13 22.32,6.13 JP3.4 | T2.2 35.17,9.44 v34.61,10
  Bottom 0.305: U$1.18 13,9.28 13,9.07 13.42,8.65 13.42,7.06 v13.4,6.81 | JP3.4 24.28,5.78 24.69,6.19 33.98,6.19 34.29,6.51 34.29,9.68 v34.61,10
VCC  (via drill 0.6, 0.8)
  Top 0.406: v27.71,10.4 27.71,9.45 27.39,8.97 27.39,6.91 28.02,6.27 30.56,6.27 31.83,5 31.83,4.24 JP3.1 | v39.93,31.2 41.12,30 v41.12,24.37
  Top 0.61: v15.24,27.62 15.56,28.02 15.88,28.34 21.83,28.34 22.78,27.38 22.78,26.51 23.18,26.11 23.18,23.02 21.91,21.75 21.59,21.75 v19.77,19.92
  Bottom 0.406: 44.81,12.2 R25.2 44.8,9.86 44.79,9.85 | 31.95,3.09 31.95,4.12 JP3.1 | 42.15,38.13 41.47,38.13 41.45,38.15 41.45,37.33 R7.2 38.02,36.03 37.87,35.88 37.87,31.91 38.03,31.75 39.45,31.67 v39.93,31.2 | 42.15,38.13 R9.1 | 42.15,38.13 42.08,38.2 | R20.1 20.37,10.71 | R20.1 20.14,8.48 19.98,8.32 R18.1 19.98,9.66 20.09,9.76 25.01,9.76 25.64,10.4 v27.71,10.4 | R14.1 21.04,20.08 | 20.88,19.92 21.04,20.08 | 20.88,19.92 20.88,11.99 20.54,11.64 R20.1 | 48.93,21.74 48.83,21.74 L1.1 46.76,23.1 45.49,23.1 44.22,24.37 v41.12,24.37 39.82,24.37 39.69,24.21 R33.2 | 20.88,19.92 v19.77,19.92 | 21.04,20.08 20.88,19.92
  Bottom 0.61: 47.04,18.81 v46.52,18.81
  Bottom 0.813: 44.81,12.2 C9.+ 47.04,15.89 47.04,18.81 46.64,19.06 48.93,21.74 | 31.95,3.09 33.12,3.09 33.41,2.8 38.62,2.8 44.79,8.97 44.79,9.85
VCC_LPC  (via drill 0.6)
  Top 0.305: v11.83,13.34 11.83,12.62 10.48,11.27 9.85,11.27 8.89,12.22 8.89,17.07 v9.37,17.62
  Bottom 0.305: C4.2 12.47,4.84 11.2,5.64 10.63,6.2 10.63,8.74 11.03,9.15 U$1.21 11.02,11.73 11.28,11.99 11.28,12.78 v11.83,13.34 | C6.2 8.54,21.84 Q2.1 Q2.4 8.82,19.39 8.82,18.26 v9.37,17.62
  Bottom 0.406: C4.2 15.32,3.74 16.84,2.2 28.87,2.2 29.4,2.7 29.4,4.13 JP3.2
(copper drawn outside any net)
  shapes: Top area x1

### Text on the board
tPlace: BJ_G_Taster_4.4 | +EIB-
tValues: GND | VCC | INT0 | P2.2 | PWM | P2.3 | P2.0 | P2.7
Mechanik: Material Edelstahl 0,8mm | Einheit ist mm Aussenmasse (70.8x70.8)